# EAGLE design Zio Qwiic Booster (EAGLE 8.7.1)
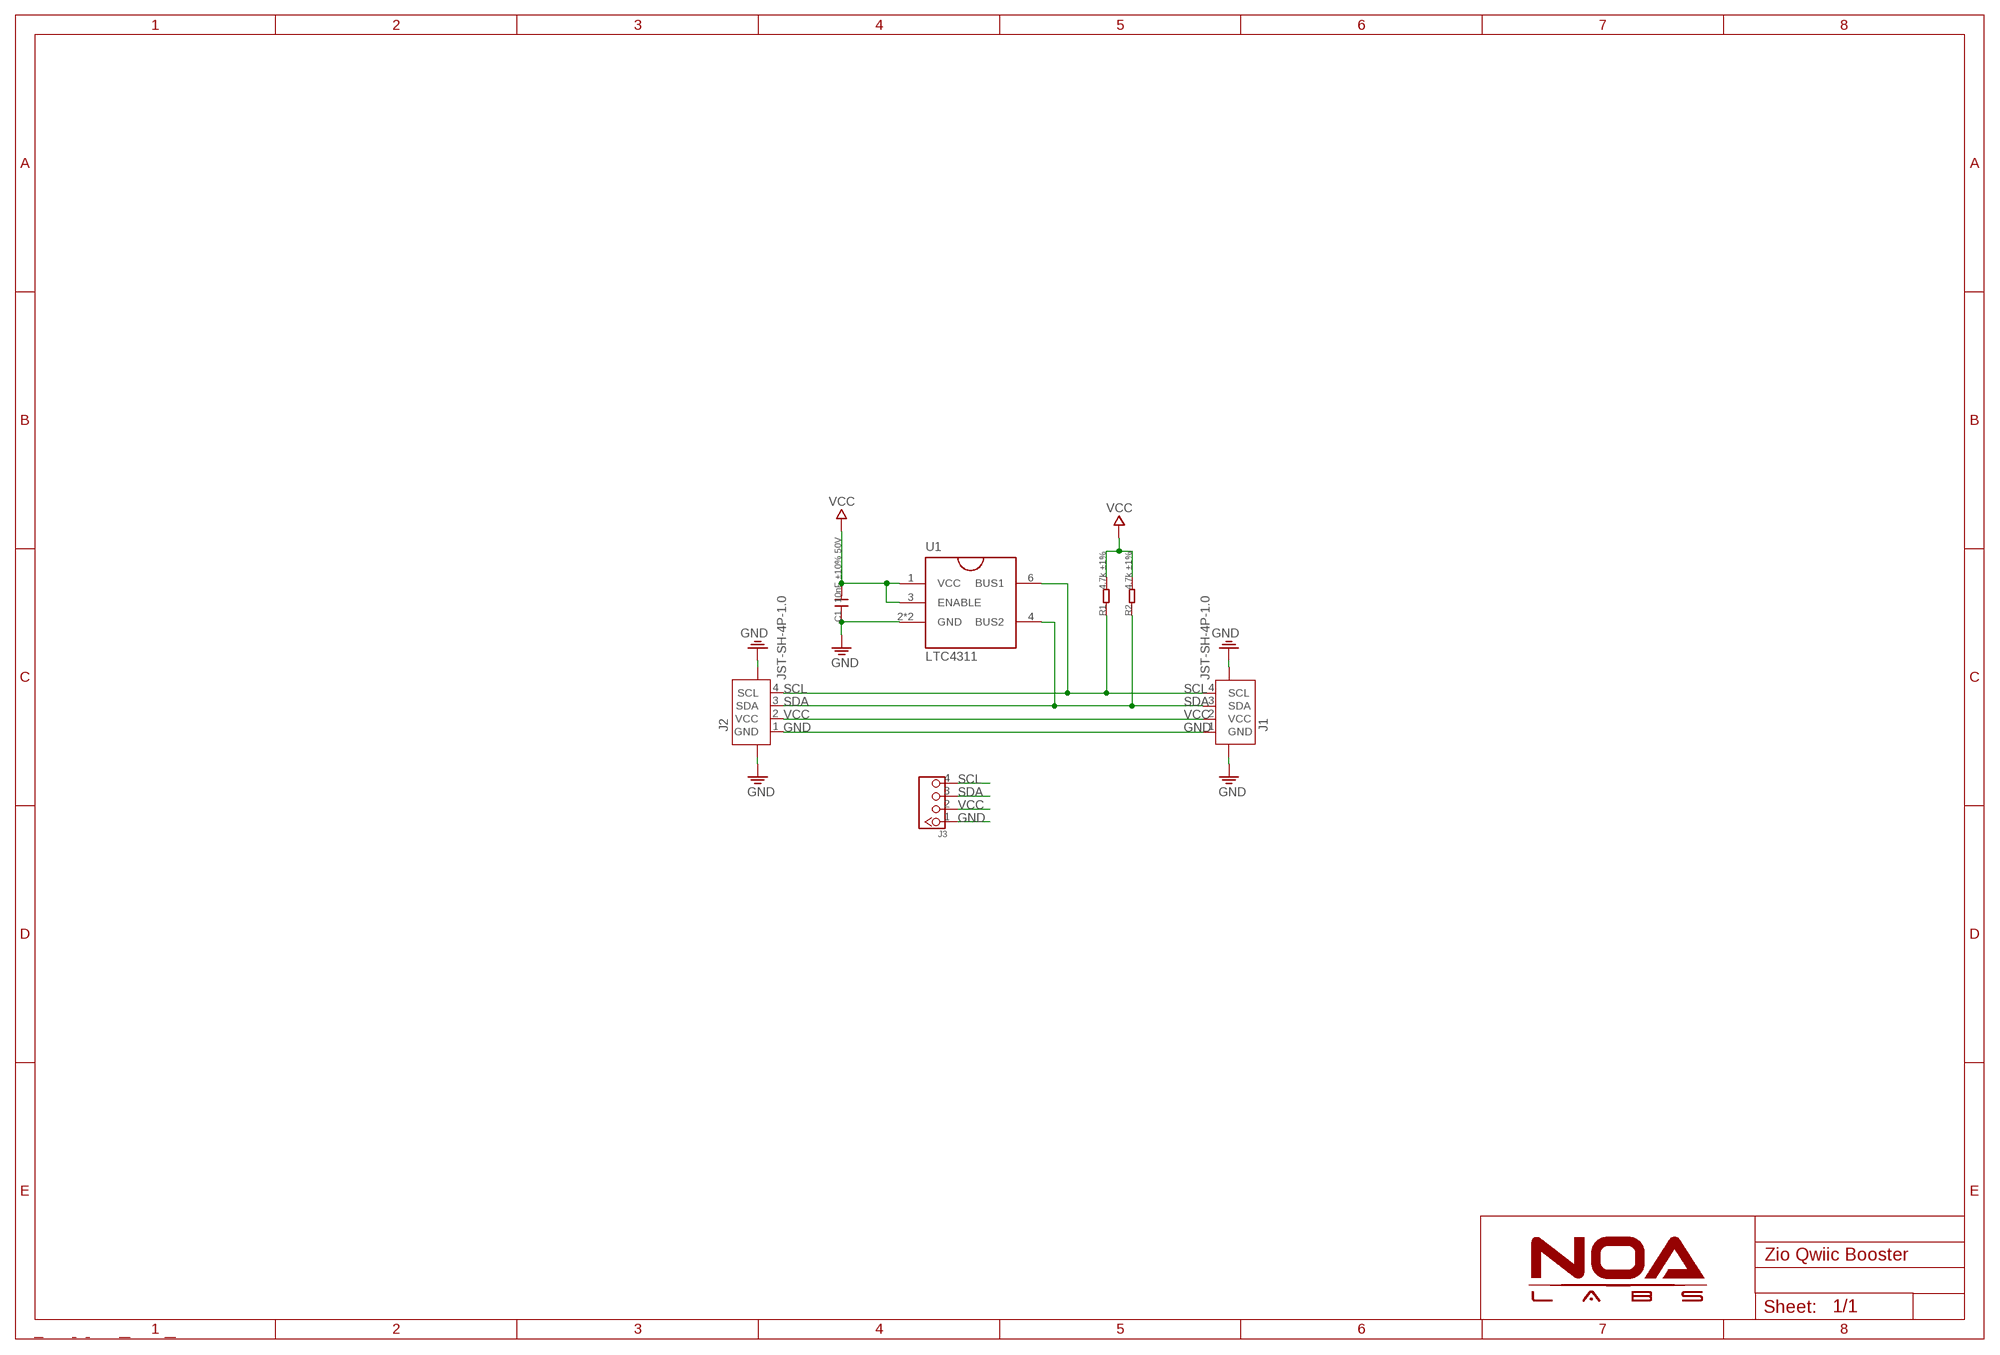
[diagram p0: schematic, sheet 1]

## Parts
C1  10nF ±10% 50V  C-0603  [0603]
J1  JST-SH-4P-1.0  [JST-SH-4P]
J2  JST-SH-4P-1.0  [JST-SH-4P]
J3  HEADER-4P-60/35MIL  [4P-65/35MIL]
R1  4.7k ±1%  R-0603  [0603]
R2  4.7k ±1%  R-0603  [0603]
U1  LTC4311  [SC70-6L]

## Nets
GND: C1.1 J1.1(GND) J1.NC1 J1.NC2 J2.1(GND) J2.NC1 J2.NC2 J3.1 U1.2(GND) U1.5(GND)
SCL: J1.4(SCL) J2.4(SCL) J3.4 R1.1 U1.6(BUS1)
SDA: J1.3(SDA) J2.3(SDA) J3.3 R2.1 U1.4(BUS2)
VCC: C1.2 J1.2(VCC) J2.2(VCC) J3.2 R1.2 R2.2 U1.1(VCC) U1.3(ENABLE)

## Library data of the parts
C1 = Discretex:C*: Ceramic Capacitors
J1 J2 = Connector:JST-SH-4P
J3 = Connector:HEADER-4P
R1 R2 = Discretex:R*
U1 = IC:LTC4311

## Board
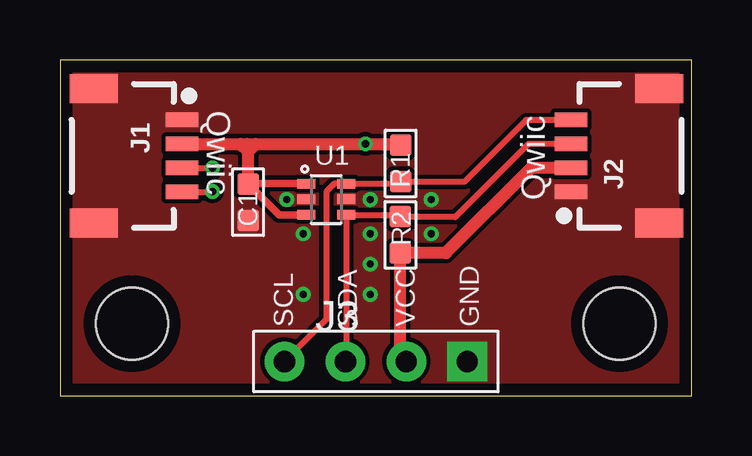
[diagram p1: board, top side]
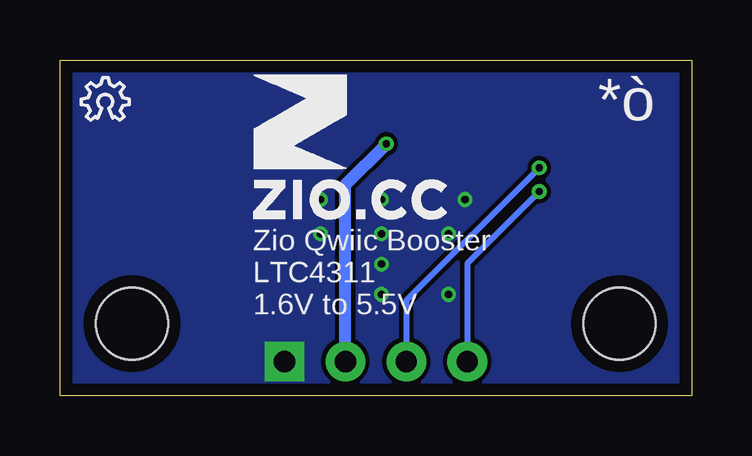
[diagram p2: board, bottom side, seen from below]

Size 26.32 x 14 mm. Coordinates in mm from the lower left corner, seen from the top.
Outline: 0,0 26.32,0 26.32,14 0,14 0,0
Copper layers (1*16): Top 0.035mm / dielectric 1.5mm / Bottom 0.035mm
Design rules "NOA Eagle Rule": minimum track width 7mil, minimum drill 12mil, track to track 7mil, track to pad 7mil, pad to pad 7mil, via to via 7mil, smd to smd 0mil, copper to edge 20mil, drill to drill 10mil, minimum pad ring 10mil, minimum via ring 6mil, stop-mask expansion 2mil, vias tented up to drill 25mil, thermal gap 10mil
Holes 3 mm at 3,3 23.32,3

### Footprints (pad centres in the part's own frame; a part is rotated, then mirrored left to right if it is on the bottom)
0603 = smd 0.889 x 0.889: 1 -0.762,0; 2 0.762,0
JST-SH-4P = smd 0.6 x 1.35: 1 1.5,0; 2 0.5,0; 3 -0.5,0; 4 -1.5,0 | smd 1.2 x 2: NC1 -2.8,3.675; NC2 2.8,3.675
4P-65/35MIL = drill 0.889 pad 1.651 square: 1 0,3.81 | drill 0.889 pad 1.651: 2 0,1.27; 3 0,-1.27; 4 0,-3.81
SC70-6L = smd 0.4 x 0.75: 1 -0.65,-0.825; 2 0,-0.825; 3 0.65,-0.825; 4 0.65,0.825; 5 -0.015,0.825; 6 -0.65,0.825

### Placement (x,y rotation side)
C1  7.84,8.06 90 top
J1  5.08,10 90 top
J2  21.3,10 270 top
J3  13.16,1.42 270 top
R1  14.19,9.68 90 top
R2  14.18,6.7 270 top
U1  11.09,8.18 270 top
U$3  [6MM]  18.29,7.37 0 bottom
U$4  [OSHW_6X70_NOTEXT]  25.43,11.48 0 bottom

### Tracks (layer width: path | path; a pad name or v marks a point on that pad's centre or on a via)
GND  (via drill 0.3)
  other vias: 12.93,8.18 15.47,8.18 15.47,6.76 12.93,6.76 12.93,5.49 12.93,4.22 10.13,4.22 10.13,6.76 9.45,8.18
  pour Bottom (no thermals): 0,14 26.31,14 26.31,0 0,0
  pour Top (no thermals): 0,14 26.31,14 26.31,0 0,0
SCL  (via drill 0.3)
  Top 0.254: J3.4 11.1,3.17 11.1,8.51 11.42,8.83 U1.6 14.1,8.83 R1.1 16.84,8.91 19.43,11.5 J2.4 | J1.4 v6.34,8.5 v6.35,8.51
  Bottom 0.254: v6.35,8.51 9.35,5.51 J3.4
SDA  (via drill 0.3)
  Top 0.254: J3.3 11.92,1.45 U1.4 14.11,7.53 R2.1 14.2,7.44 16.46,7.44 19.52,10.5 J2.3 | J1.3 v6.35,9.5 | v6.35,9.5
  Bottom 0.254: v6.35,9.5 11.89,3.96 J3.3
VCC  (via drill 0.3)
  Top 0.305: U1.1 C1.2 9.13,7.53 U1.3
  Top 0.508: J2.2 19.64,9.5 16.07,5.94 R2.2 14.18,1.67 J3.2 | R1.2 14.13,10.5 v12.72,10.5 8.15,10.5 | J1.2 7.52,10.5 | 7.52,10.5 7.8,10.5 | 7.8,10.5 8.15,10.5 | C1.2 7.84,10.18 | 7.84,10.19 7.84,10.46 7.8,10.5 | 7.84,10.18 7.52,10.5 | 7.84,10.18 7.84,10.19 | 7.84,10.19 8.15,10.5
  Bottom 0.508: J3.2 14.43,8.79 v12.72,10.5

### Text on the board
tPlace: Qwiic | Qwiic | SCL | SDA | VCC | GND
bPlace: *ò | Zio Qwiic Booster / LTC4311 / 1.6V to 5.5V